# Altium project Drone.PrjPcb (part 2 of 2)

## Sheet Power.SchDoc
size A4
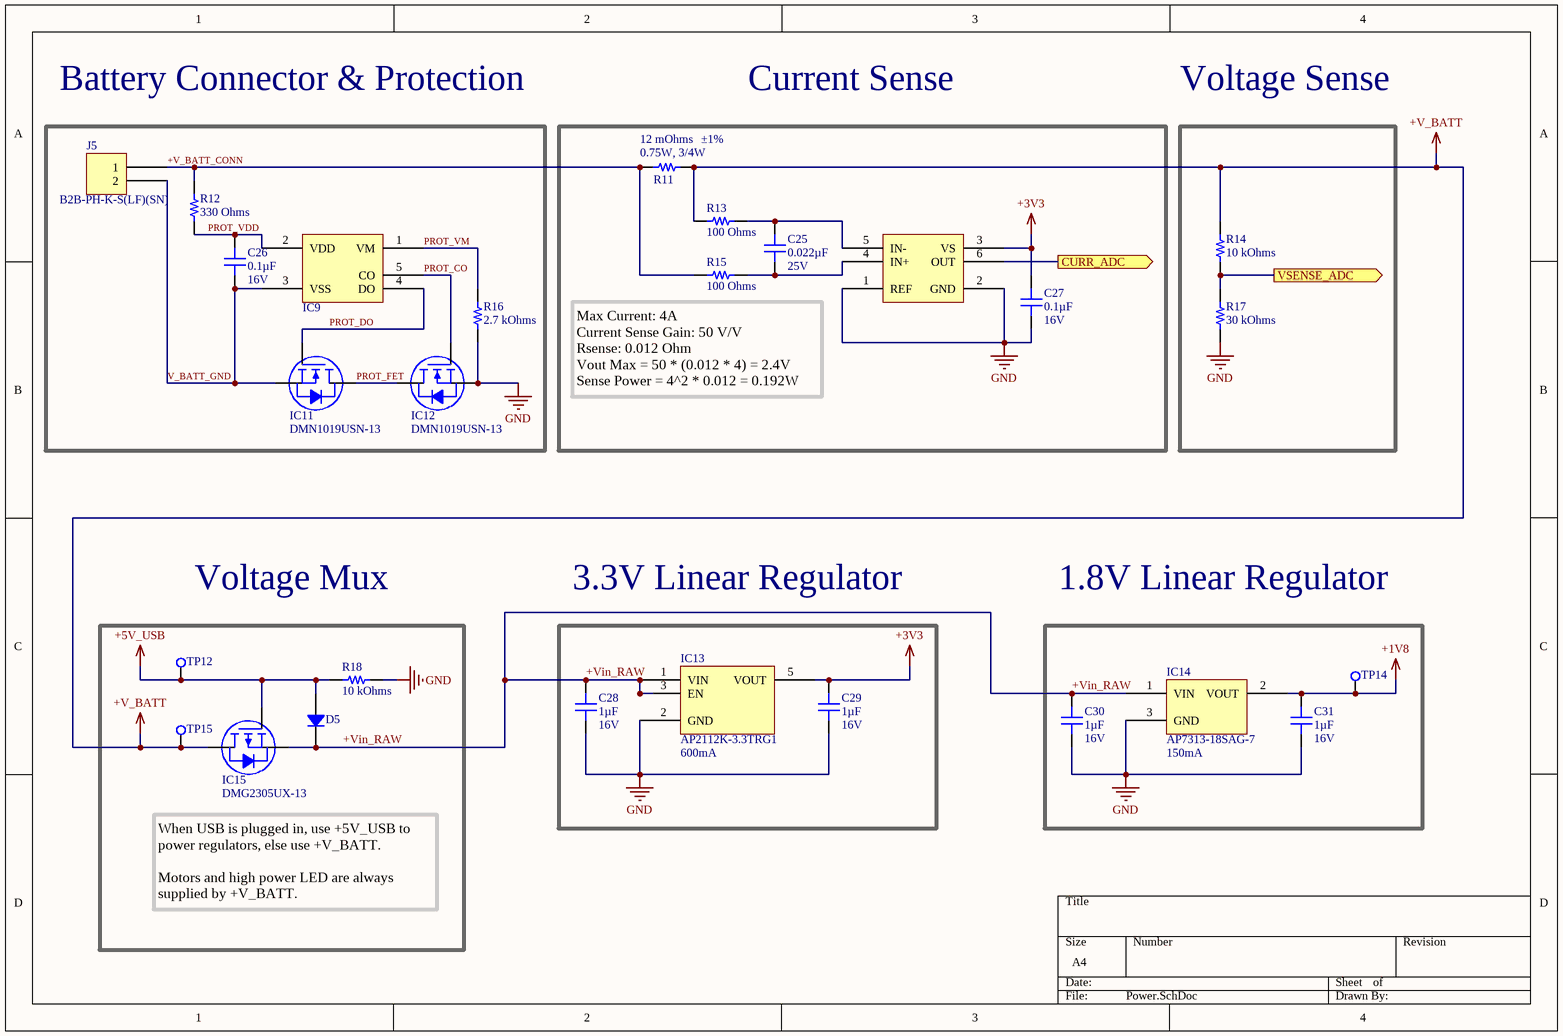
[diagram p3: Power.SchDoc]

### Parts
C25  Voltage - Rated: 25V  [CAP 0603_1608]  (hidden comment: 0.022µF)
C26  Voltage - Rated: 16V  [CAP 0603_1608]  (hidden comment: 0.1µF)
C27  Voltage - Rated: 16V  [CAP 0603_1608]  (hidden comment: 0.1µF)
C28  Voltage - Rated: 16V  [CAP 0603_1608]  (hidden comment: 1µF)
C29  Voltage - Rated: 16V  [CAP 0603_1608]  (hidden comment: 1µF)
C30  Voltage - Rated: 16V  [CAP 0603_1608]  (hidden comment: 1µF)
C31  Voltage - Rated: 16V  [CAP 0603_1608]  (hidden comment: 1µF)
D5  SS1FL3-M3/H  [SMF DO-219AB]  (value not drawn)
IC9  AP9101CK-AHTRG1  [SOT95P285X140-5N]  (value not drawn)
IC10  INA190A2IDCKT  [SOT65P210X110-6N]  (value not drawn)
IC11  DMN1019USN-13  [DIODES SOT-23-3]
IC12  DMN1019USN-13  [DIODES SOT-23-3]
IC13  AP2112K-3.3TRG1  Current - Output: 600mA  [DIODES SOT-23-5 W5]
IC14  AP7313-18SAG-7  Current - Output: 150mA  [DIODES SOT-23-3]
IC15  DMG2305UX-13  [DIODES SOT-23-3]
J5  B2B-PH-K-S(LF)(SN)  [JST B2B-PH-K]
R11  12 mOhms  Power (Watts): 0.75W, 3/4W  Tolerance: ±1%  [STACKPOLE CSR1206]
R12  330 Ohms  [RES 0603_1608]
R13  100 Ohms  [RES 0603_1608]
R14  10 kOhms  [RES 0603_1608]
R15  100 Ohms  [RES 0603_1608]
R16  2.7 kOhms  [RES 0603_1608]
R17  30 kOhms  [RES 0603_1608]
R18  10 kOhms  [RES 0603_1608]
TP12  TestPoint  [TestPoint]  (value not drawn)  (no BOM)
TP14  TestPoint  [TestPoint]  (value not drawn)  (no BOM)
TP15  TestPoint  [TestPoint]  (value not drawn)  (no BOM)

### Ports
CURR_ADC (out), VSENSE_ADC (out)

### Nets
+1V8: C31.2 IC14.2(VOUT) TP14.1
+3V3: C27.1 C29.2 IC10.3(VS) IC13.5(VOUT)
+5V_USB: D5.1 IC15.1(G) R18.2 TP12.1
+V_BATT: IC15.3(D) R11.2 R13.2 R14.1 TP15.1
GND: C27.2 C28.1 C29.1 C30.1 C31.1 IC10.1(REF) IC10.2(GND) IC12.2(S) IC13.2(GND) IC14.3(GND) R16.1 R17.1 R18.1
+V_BATT_CONN: J5.1 R11.1 R12.2 R15.2
+Vin_RAW: C28.2 C30.2 D5.2 IC13.1(VIN) IC13.3(EN) IC14.1(VIN) IC15.2(S)
CURR_ADC: IC10.6(OUT) ; port CURR_ADC
PROT_CO: IC9.5(CO) IC12.1(G)
PROT_DO: IC9.4(DO) IC11.1(G)
PROT_FET: IC11.3(D) IC12.3(D)
PROT_VDD: C26.2 IC9.2(VDD) R12.1
PROT_VM: IC9.1(VM) R16.2
V_BATT_GND: C26.1 IC9.3(VSS) IC11.2(S) J5.2
VSENSE_ADC: R14.2 R17.2 ; port VSENSE_ADC
NetC25_1: C25.1 IC10.4(IN+) R15.1
NetC25_2: C25.2 IC10.5(IN-) R13.1

### Notes on the sheet
- Battery Connector & Protection
- Current Sense
- Voltage Sense
- Max Current: 4A
  Current Sense Gain: 50 V/V
  Rsense: 0.012 Ohm
  Vout Max = 50 * (0.012 * 4) = 2.4V
  Sense Power = 4^2 * 0.012 = 0.192W
- Voltage Mux
- 3.3V Linear Regulator
- 1.8V Linear Regulator
- When USB is plugged in, use +5V_USB to power regulators, else use +V_BATT.
  Motors and high power LED are always supplied by +V_BATT.

### Library data of the parts
C25 = CC0603JRX7R8BB223: CAP CER 0.022UF 25V X7R 0603; Manufacturer: Yageo; Tolerance: ±5%; Part Number: CC0603JRX7R8BB223; Value: 0.022µF; Applications: General Purpose; Capacitance: 0.022µF; ComponentLink1Description: Datasheet; ComponentLink1URL: https://www.yageo.com/upload/media/product/productsearch/datasheet/mlcc/UPY-GPHC_X7R_6.3V-to-50V_18.pdf; ComponentLink2Description: DigiKey Link; ComponentLink2URL: http://digikey.com/product-detail/en/yageo/CC0603JRX7R8BB223/311-3998-1-ND/8025087; Device Package: 0603 (1608 Metric); LastUpdated: 9/2/2020 1:03:31 AM; Lifecycle Status: Active; Minimum Order: 1; Mounting Type: Surface Mount, MLCC; Operating Temperature: -55°C ~ 125°C; Package / Case: 0603 (1608 Metric); Packaging: TapeAndReel; PartId: 5308; Part Status: Active; Price: 0.01; Series: CC; Size / Dimension: 0.063" L x 0.031" W (1.60mm x 0.80mm); Supplier 1: DigiKey; Supplier Part Number 1: 311-3998-1-ND; Temperature Coefficient: X7R; Thickness (Max): 0.035" (0.90mm)
C26 C27 = CC0603KRX7R7BB104: CAP CER 0.1UF 16V X7R 0603; Manufacturer: Yageo; Tolerance: ±10%; Part Number: CC0603KRX7R7BB104; Value: 0.1µF; Applications: General Purpose; Capacitance: 0.1µF; ComponentLink1Description: Datasheet; ComponentLink1URL: https://www.yageo.com/upload/media/product/productsearch/datasheet/mlcc/UPY-GPHC_X7R_6.3V-to-50V_18.pdf; ComponentLink2Description: DigiKey Link; ComponentLink2URL: http://digikey.com/product-detail/en/yageo/CC0603KRX7R7BB104/311-1088-1-ND/302998; Device Package: 0603 (1608 Metric); LastUpdated: 9/2/2020 1:03:05 AM; Lifecycle Status: Active; Minimum Order: 1; Mounting Type: Surface Mount, MLCC; Operating Temperature: -55°C ~ 125°C; Package / Case: 0603 (1608 Metric); Packaging: TapeAndReel; PartId: 16746; Part Status: Active; Price: 0.01; Series: CC; Size / Dimension: 0.063" L x 0.031" W (1.60mm x 0.80mm); Supplier 1: DigiKey; Supplier Part Number 1: 311-1088-1-ND; Temperature Coefficient: X7R; Thickness (Max): 0.035" (0.90mm)
C28-C31 = CC0603MRX5R7BB105: CAP CER 1UF 16V X5R 0603; Manufacturer: Yageo; Tolerance: ±20%; Part Number: CC0603MRX5R7BB105; Value: 1µF; Applications: General Purpose; Capacitance: 1µF; ComponentLink1Description: Datasheet; ComponentLink1URL: https://www.yageo.com/upload/media/product/productsearch/datasheet/mlcc/UPY-GPHC_X5R_4V-to-50V_25.pdf; ComponentLink2Description: DigiKey Link; ComponentLink2URL: http://digikey.com/product-detail/en/yageo/CC0603MRX5R7BB105/311-1821-1-ND/5195723; Device Package: 0603 (1608 Metric); LastUpdated: 9/2/2020 1:03:23 AM; Lifecycle Status: Active; Minimum Order: 1; Mounting Type: Surface Mount, MLCC; Operating Temperature: -55°C ~ 85°C; Package / Case: 0603 (1608 Metric); Packaging: TapeAndReel; PartId: 9229; Part Status: Active; Price: 0.02; Series: CC; Size / Dimension: 0.063" L x 0.031" W (1.60mm x 0.80mm); Supplier 1: DigiKey; Supplier Part Number 1: 311-1821-1-ND; Temperature Coefficient: X5R; Thickness (Max): 0.035" (0.90mm)
D5 = SS1FL3-M3/H: DIODE SCHOTTKY 30V 1A DO-219AB; Manufacturer: Vishay Semiconductor Diodes Division; Capacitance @ Vr, F: 130pF @ 4V, 1MHz; Current - Reverse Leakage @ Vr: 200µA @ 30V; Speed: Fast Recovery =< 500ns, > 200mA (Io); Voltage - Forward (Vf) (Max) @ If: 480mV @ 1A; Part Number: SS1FL3-M3/H; ComponentLink1Description: Datasheet; ComponentLink1URL: http://www.vishay.com/docs/87614/ss1fl3.pdf; ComponentLink2Description: DigiKey Link; ComponentLink2URL: http://digikey.com/product-detail/en/vishay-semiconductor-diodes-division/SS1FL3-M3-H/SS1FL3-M3-HGICT-ND/6012990; Current - Average Rectified (Io): 1A; Diode Type: Schottky; LastUpdated: 9/2/2020 1:23:13 AM; Lifecycle Status: Active; Minimum Order: 1; Mounting Type: Surface Mount; Operating Temperature - Junction: -55°C ~ 150°C; Package / Case: DO-219AB; Packaging: TapeAndReel; PartId: 1332; Part Status: Active; Price: 0.11; Series: Automotive, AEC-Q101, eSMP®; Supplier 1: DigiKey; Supplier Part Number 1: SS1FL3-M3/HGICT-ND; Supplier Device Package: DO-219AB (SMF); Voltage - DC Reverse (Vr) (Max): 30V
IC9 = AP9101CK-AHTRG1: IC BATT PROT LI-ION 1-CELL SOT25; Manufacturer: Diodes; Number of Cells: 1; Fault Protection: Over Current,Over Voltage; Supplier 1: Digi-Key; Manufacturer Part Number: AP9101CK-AHTRG1; RoHS: Yes; Category: Battery Management; Stock 1: 1598; Pricing 1: 1=0.44000, 10=0.35300, 100=0.20250, 500=0.18750, 1000=0.12750 (USD); Case/Package: SOT-25; Min Operating Temperature: -40°C; Max Operating Temperature: 85°C; Packaging: Tape and Reel; ComponentLink1URL: http://www.mouser.com/ds/2/115/AP9101C-776313.pdf?src-supplier=Mouser; ComponentLink1Description: http://www.mouser.com/ds/2/115/AP9101C-776313.pdf?src-supplier=Mouser; ComponentLink2URL: https://www.diodes.com/assets/Datasheets/AP9101C.pdf?src-supplier=Digi-Key; ComponentLink2Description: https://www.diodes.com/assets/Datasheets/AP9101C.pdf?src-supplier=Digi-Key; Supplier Part Number 1: AP9101CK-AHTRG1DICT-ND
IC10 = INA190A2IDCKT: Precision Current-Sense Amplifier Bi-Directional 1-Channel 50V/V 1.7V to 5.5V 6-Pin SC-70 T/R; Manufacturer: Texas Instruments; Supplier 1: Digi-Key; Manufacturer Part Number: INA190A2IDCKT; RoHS: Yes; Category: Amplifiers - Op Amps, Buffer, Instrumentation; Stock 1: 103; Pricing 1: 1=3.20000, 10=2.87300, 25=2.71640, 100=2.23360 (USD); Supplier Part Number 1: 296-INA190A2IDCKTCT-ND
IC11 IC12 = DMN1019USN-13: MOSFET N-CH 12V 9.3A SC59; Manufacturer: Diodes Incorporated; Current - Continuous Drain (Id) @ 25°C: 9.3A (Ta); Drive Voltage (Max Rds On,  Min Rds On): 1.2V, 2.5V; FET Type: N-Channel; Gate Charge (Qg) (Max) @ Vgs: 50.6nC @ 8V; Input Capacitance (Ciss) (Max) @ Vds: 2426pF @ 10V; Power Dissipation (Max): 680mW (Ta); Rds On (Max) @ Id, Vgs: 10mOhm @ 9.7A, 4.5V; Vgs (Max): ±8V; Vgs(th) (Max) @ Id: 800mV @ 250µA; Part Number: DMN1019USN-13; ComponentLink1Description: Datasheet; ComponentLink1URL: https://www.diodes.com/assets/Datasheets/DMN1019USN.pdf; ComponentLink2Description: DigiKey Link; ComponentLink2URL: http://digikey.com/product-detail/en/diodes-incorporated/DMN1019USN-13/DMN1019USN-13DICT-ND/4898885; Drain to Source Voltage (Vdss): 12V; LastUpdated: 9/2/2020 1:25:02 AM; Lifecycle Status: Active; Minimum Order: 1; Mounting Type: Surface Mount; Operating Temperature: -55°C ~ 150°C (TJ); Package / Case: TO-236-3, SC-59, SOT-23-3; Packaging: TapeAndReel; Part Status: Active; Price: 0.10; Series: -; Supplier 1: DigiKey; Supplier Part Number 1: DMN1019USN-13DICT-ND; Supplier Device Package: SC-59; Technology: MOSFET (Metal Oxide)
IC13 = AP2112K-3.3TRG1: IC REG LINEAR 3.3V 600MA SOT25; Manufacturer: Diodes Incorporated; Control Features: Enable; Current - Quiescent (Iq): 80µA; Number of Regulators: 1; Output Configuration: Positive; Output Type: Fixed; Protection Features: Over Current, Over Temperature; PSRR: 65sB (100Hz ~ 1KHz); Voltage Dropout (Max): 0.4V @ 600mA; Voltage - Input (Max): 6V; Part Number: AP2112K-3.3TRG1; ComponentLink1Description: Datasheet; ComponentLink1URL: https://www.diodes.com/assets/Datasheets/AP2112.pdf; ComponentLink2Description: DigiKey Link; ComponentLink2URL: http://digikey.com/product-detail/en/diodes-incorporated/AP2112K-3.3TRG1/AP2112K-3.3TRG1DICT-ND/4505257; LastUpdated: 9/2/2020 1:25:56 AM; Lifecycle Status: Active; Minimum Order: 1; Mounting Type: Surface Mount; Operating Temperature: -40°C ~ 85°C; Package / Case: SC-74A, SOT-753; Packaging: TapeAndReel; Part Status: Active; Price: 0.10; Series: -; Supplier 1: DigiKey; Supplier Part Number 1: AP2112K-3.3TRG1DICT-ND; Supplier Device Package: SOT-25; Voltage - Output (Min/Fixed): 3.3V
IC14 = AP7313-18SAG-7: IC REG LINEAR 1.8V 150MA SOT23-3; Manufacturer: Diodes Incorporated; Current - Quiescent (Iq): 75µA; Current - Supply (Max): 85µA; Number of Regulators: 1; Output Configuration: Positive; Output Type: Fixed; Protection Features: Over Current, Over Temperature, Short Circuit; PSRR: 65dB (100Hz); Voltage - Input (Max): 6V; Part Number: AP7313-18SAG-7; ComponentLink1Description: Datasheet; ComponentLink1URL: https://www.diodes.com/assets/Datasheets/AP7313.pdf; ComponentLink2Description: DigiKey Link; ComponentLink2URL: http://digikey.com/product-detail/en/diodes-incorporated/AP7313-18SAG-7/AP7313-18SAG-7DICT-ND/2270838; LastUpdated: 9/2/2020 1:24:49 AM; Lifecycle Status: Active; Minimum Order: 1; Mounting Type: Surface Mount; Operating Temperature: -40°C ~ 85°C; Package / Case: TO-236-3, SC-59, SOT-23-3; Packaging: TapeAndReel; Part Status: Active; Price: 0.11; Series: -; Supplier 1: DigiKey; Supplier Part Number 1: AP7313-18SAG-7DICT-ND; Supplier Device Package: SOT-23-3; Voltage - Output (Min/Fixed): 1.8V
IC15 = DMG2305UX-13: MOSFET P-CH 20V 4.2A SOT23; Manufacturer: Diodes Incorporated; Current - Continuous Drain (Id) @ 25°C: 4.2A (Ta); Drive Voltage (Max Rds On,  Min Rds On): 1.8V, 4.5V; FET Type: P-Channel; Gate Charge (Qg) (Max) @ Vgs: 10.2nC @ 4.5V; Input Capacitance (Ciss) (Max) @ Vds: 808pF @ 15V; Power Dissipation (Max): 1.4W (Ta); Rds On (Max) @ Id, Vgs: 52mOhm @ 4.2A, 4.5V; Vgs (Max): ±8V; Vgs(th) (Max) @ Id: 900mV @ 250µA; Part Number: DMG2305UX-13; ComponentLink1Description: Datasheet; ComponentLink1URL: https://www.diodes.com/assets/Datasheets/DMG2305UX.pdf; ComponentLink2Description: DigiKey Link; ComponentLink2URL: http://digikey.com/product-detail/en/diodes-incorporated/DMG2305UX-13/DMG2305UX-13DICT-ND/4251589; Drain to Source Voltage (Vdss): 20V; LastUpdated: 9/2/2020 1:25:04 AM; Lifecycle Status: Active; Minimum Order: 1; Mounting Type: Surface Mount; Operating Temperature: -55°C ~ 150°C (TJ); Package / Case: TO-236-3, SC-59, SOT-23-3; Packaging: TapeAndReel; Part Status: Active; Price: 0.05; Series: -; Supplier 1: DigiKey; Supplier Part Number 1: DMG2305UX-13DICT-ND; Supplier Device Package: SOT-23; Technology: MOSFET (Metal Oxide)
J5 = B2B-PH-K-S(LF)(SN): CONN HEADER VERT 2POS 2MM; Manufacturer: JST Sales America Inc.; Contact Length - Mating: 0.130" (3.30mm); Contact Length - Post: 0.134" (3.40mm); Current Rating (Amps): 2A; Material Flammability Rating: UL94 V-0; Number of Positions: 2; Number of Positions Loaded: All; Overall Contact Length: 0.333" (8.45mm); Pitch - Mating: 0.079" (2.00mm); Shrouding: Shrouded - 4 Wall; Style: Board to Cable/Wire; Voltage Rating: 100V; Part Number: B2B-PH-K-S(LF)(SN); ComponentLink1Description: Datasheet; ComponentLink1URL: http://www.jst-mfg.com/product/pdf/eng/ePH.pdf; ComponentLink2Description: DigiKey Link; ComponentLink2URL: http://digikey.com/product-detail/en/jst-sales-america-inc/B2B-PH-K-S-LF-SN/455-1704-ND/926611; Connector Type: Header; Contact Finish - Mating: Tin; Contact Finish - Post: Tin; Contact Material: Brass; Contact Shape: Square; Contact Type: Male Pin; Fastening Type: Detent Lock; Insulation Color: Natural; Insulation Height: 0.236" (6.00mm); Insulation Material: Polyamide (PA66), Nylon 6/6; LastUpdated: 1/3/2020 11:40:58 PM; Lifecycle Status: Active; Minimum Order: 1; Mounting Type: Through Hole; Number of Rows: 1; Operating Temperature: -25°C ~ 85°C; Packaging: Bulk; PartId: 11; Part Status: Active; Price: 0.17; Series: PH; Supplier 1: DigiKey; Supplier Part Number 1: 455-1704-ND; Termination: Press-Fit, Solder
R11 = KRL1632E-M-R012-F-T5: RES 0.012 OHM 1% 3/4W 1206; Manufacturer: Susumu; Temperature Coefficient: ±50ppm/°C; Part Number: KRL1632E-M-R012-F-T5; Package / Case: 1206 (3216 Metric); ComponentLink1Description: Datasheet; ComponentLink1URL: http://www.susumu.co.jp/common/pdf/n_catalog_partition09_en.pdf; ComponentLink2Description: DigiKey Link; ComponentLink2URL: http://digikey.com/product-detail/en/susumu/KRL1632E-M-R012-F-T5/408-1571-1-ND/3737753; Composition: Metal Foil; Device Package: 1206 (3216 Metric); Features: Automotive AEC-Q200, Current Sense; Height - Seated (Max): 0.028" (0.70mm); LastUpdated: 9/2/2020 1:17:50 AM; Lifecycle Status: Active; Minimum Order: 1; Number of Terminations: 2; Operating Temperature: -55°C ~ 155°C; Packaging: TapeAndReel; PartId: 2675; Part Status: Active; Price: 0.09; Ratings: AEC-Q200; Resistance: 12 mOhms; Series: KRL; Size / Dimension: 0.126" L x 0.063" W (3.20mm x 1.60mm); Supplier 1: DigiKey; Supplier Part Number 1: 408-1571-1-ND; Supplier Device Package: 1206; Value: 12 mOhms
R12 = AC0603FR-07330RL: RES SMD 330 OHM 1% 1/10W 0603; Manufacturer: Yageo; Power (Watts): 0.1W, 1/10W; Temperature Coefficient: ±100ppm/°C; Part Number: AC0603FR-07330RL; Value: 330 Ohms; ComponentLink1Description: Datasheet; ComponentLink1URL: https://www.yageo.com/upload/media/product/productsearch/datasheet/rchip/PYu-AC_51_RoHS_L_7.pdf; ComponentLink2Description: DigiKey Link; ComponentLink2URL: http://digikey.com/product-detail/en/yageo/AC0603FR-07330RL/YAG3595CT-ND/6006444; Composition: Thick Film; Device Package: 0603 (1608 Metric); Features: Automotive AEC-Q200, Moisture Resistant; Height - Seated (Max): 0.022" (0.55mm); LastUpdated: 9/2/2020 1:09:46 AM; Lifecycle Status: Active; Minimum Order: 1; Number of Terminations: 2; Operating Temperature: -55°C ~ 155°C; Package / Case: 0603 (1608 Metric); Packaging: CutTape; PartId: 22572; Part Status: Active; Price: 0.10; Ratings: AEC-Q200; Resistance: 330 Ohms; Series: AC; Size / Dimension: 0.063" L x 0.031" W (1.60mm x 0.80mm); Supplier 1: DigiKey; Supplier Part Number 1: YAG3595CT-ND; Supplier Device Package: 0603; Tolerance: ±1%
R13 R15 = AC0603FR-07100RL: RES SMD 100 OHM 1% 1/10W 0603; Manufacturer: Yageo; Power (Watts): 0.1W, 1/10W; Temperature Coefficient: ±100ppm/°C; Part Number: AC0603FR-07100RL; Value: 100 Ohms; ComponentLink1Description: Datasheet; ComponentLink1URL: https://www.yageo.com/upload/media/product/productsearch/datasheet/rchip/PYu-AC_51_RoHS_L_7.pdf; ComponentLink2Description: DigiKey Link; ComponentLink2URL: http://digikey.com/product-detail/en/yageo/AC0603FR-07100RL/YAG3561CT-ND/6006410; Composition: Thick Film; Device Package: 0603 (1608 Metric); Features: Automotive AEC-Q200, Moisture Resistant; Height - Seated (Max): 0.022" (0.55mm); LastUpdated: 9/2/2020 1:09:58 AM; Lifecycle Status: Active; Minimum Order: 1; Number of Terminations: 2; Operating Temperature: -55°C ~ 155°C; Package / Case: 0603 (1608 Metric); Packaging: CutTape; PartId: 17348; Part Status: Active; Price: 0.10; Ratings: AEC-Q200; Resistance: 100 Ohms; Series: AC; Size / Dimension: 0.063" L x 0.031" W (1.60mm x 0.80mm); Supplier 1: DigiKey; Supplier Part Number 1: YAG3561CT-ND; Supplier Device Package: 0603; Tolerance: ±1%
R14 R18 = AC0603FR-0710KL: RES SMD 10K OHM 1% 1/10W 0603; Manufacturer: Yageo; Power (Watts): 0.1W, 1/10W; Temperature Coefficient: ±100ppm/°C; Part Number: AC0603FR-0710KL; Value: 10 kOhms; ComponentLink1Description: Datasheet; ComponentLink1URL: https://www.yageo.com/upload/media/product/productsearch/datasheet/rchip/PYu-AC_51_RoHS_L_7.pdf; ComponentLink2Description: DigiKey Link; ComponentLink2URL: http://digikey.com/product-detail/en/yageo/AC0603FR-0710KL/311-10KLDCT-ND/2828135; Composition: Thick Film; Device Package: 0603 (1608 Metric); Features: Automotive AEC-Q200, Moisture Resistant; Height - Seated (Max): 0.022" (0.55mm); LastUpdated: 9/2/2020 1:09:58 AM; Lifecycle Status: Active; Minimum Order: 1; Number of Terminations: 2; Operating Temperature: -55°C ~ 155°C; Package / Case: 0603 (1608 Metric); Packaging: CutTape; PartId: 17347; Part Status: Active; Price: 0.10; Ratings: AEC-Q200; Resistance: 10 kOhms; Series: AC; Size / Dimension: 0.063" L x 0.031" W (1.60mm x 0.80mm); Supplier 1: DigiKey; Supplier Part Number 1: 311-10KLDCT-ND; Supplier Device Package: 0603; Tolerance: ±1%
R16 = AC0603FR-072K7L: RES SMD 2.7K OHM 1% 1/10W 0603; Manufacturer: Yageo; Power (Watts): 0.1W, 1/10W; Temperature Coefficient: ±100ppm/°C; Part Number: AC0603FR-072K7L; Value: 2.7 kOhms; ComponentLink1Description: Datasheet; ComponentLink1URL: https://www.yageo.com/upload/media/product/productsearch/datasheet/rchip/PYu-AC_51_RoHS_L_7.pdf; ComponentLink2Description: DigiKey Link; ComponentLink2URL: http://digikey.com/product-detail/en/yageo/AC0603FR-072K7L/YAG3589CT-ND/6006438; Composition: Thick Film; Device Package: 0603 (1608 Metric); Features: Automotive AEC-Q200, Moisture Resistant; Height - Seated (Max): 0.022" (0.55mm); LastUpdated: 9/2/2020 1:09:58 AM; Lifecycle Status: Active; Minimum Order: 1; Number of Terminations: 2; Operating Temperature: -55°C ~ 155°C; Package / Case: 0603 (1608 Metric); Packaging: CutTape; PartId: 17370; Part Status: Active; Price: 0.10; Ratings: AEC-Q200; Resistance: 2.7 kOhms; Series: AC; Size / Dimension: 0.063" L x 0.031" W (1.60mm x 0.80mm); Supplier 1: DigiKey; Supplier Part Number 1: YAG3589CT-ND; Supplier Device Package: 0603; Tolerance: ±1%
R17 = CR0603-FX-3002ELF: RES SMD 30K OHM 1% 1/10W 0603; Manufacturer: Bourns Inc.; Power (Watts): 0.1W, 1/10W; Temperature Coefficient: ±100ppm/°C; Part Number: CR0603-FX-3002ELF; Value: 30 kOhms; ComponentLink1Description: Datasheet; ComponentLink1URL: https://www.bourns.com/docs/Product-Datasheets/CHPREZTR.pdf; ComponentLink2Description: DigiKey Link; ComponentLink2URL: http://digikey.com/product-detail/en/bourns-inc/CR0603-FX-3002ELF/CR0603-FX-3002ELFCT-ND/4247765; Composition: Thick Film; Device Package: 0603 (1608 Metric); Features: Moisture Resistant; Height - Seated (Max): 0.022" (0.55mm); LastUpdated: 9/2/2020 1:10:22 AM; Lifecycle Status: Active; Minimum Order: 1; Number of Terminations: 2; Operating Temperature: -55°C ~ 155°C; Package / Case: 0603 (1608 Metric); Packaging: CutTape; PartId: 6196; Part Status: Active; Price: 0.10; Resistance: 30 kOhms; Series: CR0603; Size / Dimension: 0.063" L x 0.031" W (1.60mm x 0.80mm); Supplier 1: DigiKey; Supplier Part Number 1: CR0603-FX-3002ELFCT-ND; Supplier Device Package: 0603; Tolerance: ±1%

## Sheet UWB.SchDoc
size A4
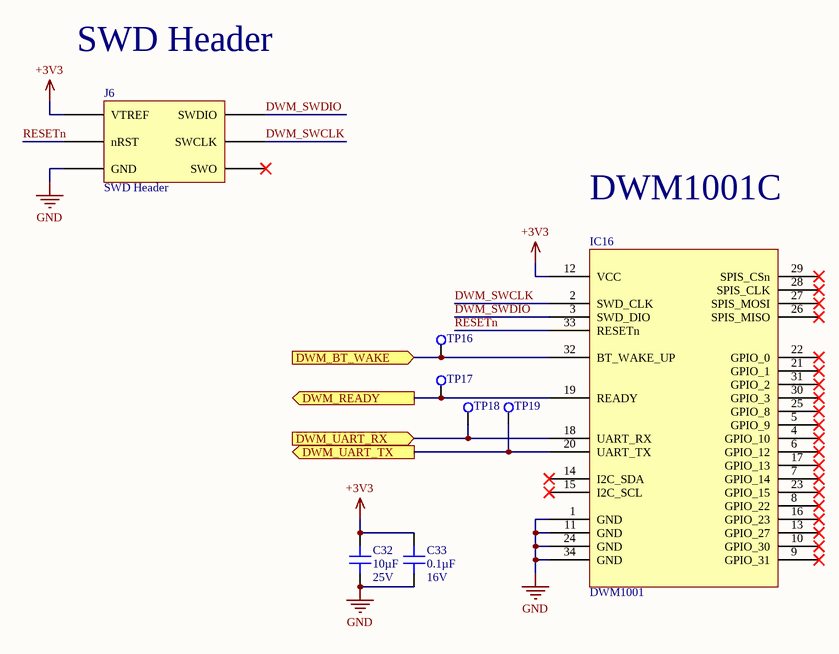
[diagram p4: UWB.SchDoc]

### Parts
C32  Voltage - Rated: 25V  [CAP 0603_1608]  (hidden comment: 10µF)
C33  Voltage - Rated: 16V  [CAP 0603_1608]  (hidden comment: 0.1µF)
IC16  DWM1001  [DWM1001]
J6  SWD Header  [SWD Header]  (no BOM)
TP16  TestPoint  [TestPoint]  (value not drawn)  (no BOM)
TP17  TestPoint  [TestPoint]  (value not drawn)  (no BOM)
TP18  TestPoint  [TestPoint]  (value not drawn)  (no BOM)
TP19  TestPoint  [TestPoint]  (value not drawn)  (no BOM)

### Ports
DWM_BT_WAKE (in), DWM_READY (out), DWM_UART_RX (in), DWM_UART_TX (out)

### Nets
+3V3: C32.2 C33.2 IC16.12(VCC) J6.VTREF
GND: C32.1 C33.1 IC16.1(GND) IC16.11(GND) IC16.24(GND) IC16.34(GND) J6.GND
DWM_BT_WAKE: IC16.32(BT_WAKE_UP) TP16.1 ; port DWM_BT_WAKE
DWM_READY: IC16.19(READY) TP17.1 ; port DWM_READY
DWM_SWCLK: IC16.2(SWD_CLK) J6.SWCLK
DWM_SWDIO: IC16.3(SWD_DIO) J6.SWDIO
DWM_UART_RX: IC16.18(UART_RX) TP18.1 ; port DWM_UART_RX
DWM_UART_TX: IC16.20(UART_TX) TP19.1 ; port DWM_UART_TX
RESETn: IC16.33(RESETn) J6.nRST

Not connected (* = marked no-connect by the designer): IC16 4(GPIO_10)* 5(GPIO_9)* 6(GPIO_12)* 7(GPIO_14)* 8(GPIO_22)* 9(GPIO_31)* 10(GPIO_30)* 13(GPIO_27)* 14(I2C_SDA)* 15(I2C_SCL)* 16(GPIO_23)* 17(GPIO_13)* 21(GPIO_1)* 22(GPIO_0)* 23(GPIO_15)* 25(GPIO_8)* 26(SPIS_MISO)* 27(SPIS_MOSI)* 28(SPIS_CLK)* 29(SPIS_CSn)* 30(GPIO_3)* 31(GPIO_2)*; J6 SWO*

### Notes on the sheet
- SWD Header
- DWM1001C

### Library data of the parts
C32 = CC0603MRX5R8BB106: CAP CER 10UF 25V X5R 0603; Manufacturer: Yageo; Tolerance: ±20%; Part Number: CC0603MRX5R8BB106; Value: 10µF; Applications: General Purpose; Capacitance: 10µF; ComponentLink1Description: Datasheet; ComponentLink1URL: https://www.yageo.com/upload/media/product/productsearch/datasheet/mlcc/UPY-GPHC_X5R_4V-to-50V_25.pdf; ComponentLink2Description: DigiKey Link; ComponentLink2URL: http://digikey.com/product-detail/en/yageo/CC0603MRX5R8BB106/311-3494-1-ND/7164515; Device Package: 0603 (1608 Metric); LastUpdated: 9/2/2020 1:02:55 AM; Lifecycle Status: Active; Minimum Order: 1; Mounting Type: Surface Mount, MLCC; Operating Temperature: -55°C ~ 85°C; Package / Case: 0603 (1608 Metric); Packaging: TapeAndReel; PartId: 27362; Part Status: Active; Price: 0.20; Series: CC; Supplier 1: DigiKey; Supplier Part Number 1: 311-3494-1-ND; Temperature Coefficient: X5R
C33 = CC0603KRX7R7BB104: as C26 on sheet Power; Part Number: CC0603KRX7R7BB104; Value: 0.1µF; Applications: General Purpose; Capacitance: 0.1µF; ComponentLink1Description: Datasheet; ComponentLink1URL: https://www.yageo.com/upload/media/product/productsearch/datasheet/mlcc/UPY-GPHC_X7R_6.3V-to-50V_18.pdf; ComponentLink2Description: DigiKey Link; ComponentLink2URL: http://digikey.com/product-detail/en/yageo/CC0603KRX7R7BB104/311-1088-1-ND/302998; Device Package: 0603 (1608 Metric); LastUpdated: 9/2/2020 1:03:05 AM; Lifecycle Status: Active; Minimum Order: 1; Mounting Type: Surface Mount, MLCC; Operating Temperature: -55°C ~ 125°C; Package / Case: 0603 (1608 Metric); Packaging: TapeAndReel; PartId: 16746; Part Status: Active; Price: 0.01; Series: CC; Size / Dimension: 0.063" L x 0.031" W (1.60mm x 0.80mm); Supplier 1: DigiKey; Supplier Part Number 1: 311-1088-1-ND; Temperature Coefficient: X7R; Thickness (Max): 0.035" (0.90mm)
IC16 = DWM1001: RF TXRX MODULE UWB/BLUETOOTH RTL; Manufacturer: DecaWave; Interface: I2C,SPI,UART; Frequency: 6.5GHz; Data Rate: 6.8Mbps; Supplier 1: Digi-Key; Manufacturer Part Number: DWM1001; RoHS: No; Mount: Surface Mount; Case/Package: SMD/SMT; Packaging: Tape and Reel; ComponentLink1URL: https://www.decawave.com/sites/default/files/dwm1001_system_overview.pdf?src-supplier=Digi-Key; ComponentLink1Description: https://www.decawave.com/sites/default/files/dwm1001_system_overview.pdf?src-supplier=Digi-Key; Supplier Part Number 1: 1479-1004-2-ND

## Nets that join several sheets
+1V8: IMU (7 pins), Power (C31.2 IC14.2 TP14.1)
+3V3: STM32 (16 pins), IMU (C16.2 IC2.19), Power (C27.1 C29.2 IC10.3 IC13.5), UWB (C32.2 C33.2 IC16.12 J6.VTREF)
+5V_USB: STM32 (J4.1), Power (D5.1 IC15.1 R18.2 TP12.1)
+V_BATT: STM32 (J2.VCC), Actuators (15 pins), Power (5 pins)
GND: STM32 (25 pins), IMU (15 pins), Actuators (16 pins), Power (13 pins), UWB (7 pins)
CURR_ADC: STM32 (IC1.27), Power (IC10.6)
DWM_BT_WAKE: STM32 (IC1.10), UWB (IC16.32 TP16.1)
DWM_READY: STM32 (IC1.9), UWB (IC16.19 TP17.1)
DWM_UART_RX: STM32 (IC1.16), UWB (IC16.18 TP18.1)
DWM_UART_TX: STM32 (IC1.17), UWB (IC16.20 TP19.1)
IM~{U}_INT: STM32 (IC1.25), IMU (IC2.14 TP1.1)
IMU_CS: STM32 (IC1.20), IMU (IC2.16 TP2.1)
IMU_MISO: STM32 (IC1.22), IMU (IC2.18 TP5.1)
IMU_MOSI: STM32 (IC1.23), IMU (IC2.17 TP3.1)
IMU_SCLK: STM32 (IC1.21), IMU (IC2.20 TP6.1)
M1_SIGNAL: STM32 (IC1.37), Actuators (IC4.1 R6.2 TP8.1)
M2_SIGNAL: STM32 (IC1.38), Actuators (IC5.1 R7.2 TP9.1)
M3_SIGNAL: STM32 (IC1.40), Actuators (IC7.1 R9.2 TP10.1)
M4_SIGNAL: STM32 (IC1.39), Actuators (IC8.1 R10.2 TP11.1)
MAIN_LED_SIGNAL: STM32 (IC1.41), Actuators (IC6.2 TP7.1)
VSENSE_ADC: STM32 (IC1.26), Power (R14.2 R17.2)